# EAGLE design placa_sensor1 (EAGLE 6.5.0)
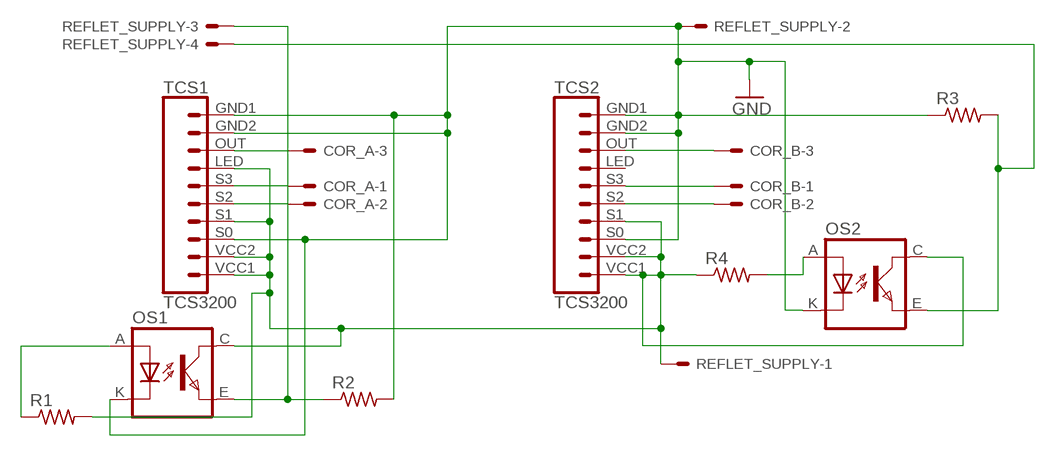
[diagram p0: schematic, sheet 1]

## Parts
COR_A  22-05-7038-03  [7395-03]
COR_B  22-05-7038-03  [7395-03]
OS1  TCRT5000  [TCRT5000]
OS2  TCRT5000  [TCRT5000]
R1  R-US_0204/5  [0204/5]
R2  R-US_0204/5  [0204/5]
R3  R-US_0204/5  [0204/5]
R4  R-US_0204/5  [0204/5]
REFLET_SUPPLY  22-05-7048-04  [7395-04]
TCS1  TCS3200  [TCS3200]
TCS2  TCS3200  [TCS3200]

## Nets
GND: OS1.K(CATHODE) OS2.K(CATHODE) R2.2 R3.1 REFLET_SUPPLY.2 TCS1.GND1 TCS1.GND2 TCS1.S0 TCS2.GND1 TCS2.GND2 TCS2.S0
N$1: COR_A.1 TCS1.S3
N$2: COR_A.3 TCS1.OUT
N$3: COR_A.2 TCS1.S2
N$4: COR_B.2 TCS2.S2
N$5: COR_B.3 TCS2.OUT
N$6: COR_B.1 TCS2.S3
N$8: OS1.A(ANODE) R1.1
N$9: OS1.E(EMITTER) R2.1 REFLET_SUPPLY.3
N$10: OS2.E(EMITTER) R3.2 REFLET_SUPPLY.4
N$11: OS2.A(ANODE) R4.2
N$12: OS1.C(COLLECTOR) OS2.C(COLLECTOR) R1.2 R4.1 REFLET_SUPPLY.1 TCS1.LED TCS1.S1 TCS1.VCC1 TCS1.VCC2 TCS2.S1 TCS2.VCC1 TCS2.VCC2
Unconnected: TCS2.LED

## Library data of the parts
COR_A COR_B = con-molex:22-?-03: CONNECTOR wire to board 2.54 mm (.1 inch) pitch header; OC_FARNELL: unknown; OC_NEWARK: unknown
OS1 OS2 = Robotica-IFRN-SC-sensores:TCRT5000
R1-R4 = rcl:R-US_: RESISTOR, American symbol
REFLET_SUPPLY = con-molex:22-?-04: CONNECTOR wire to board 2.54 mm (.1 inch) pitch header; OC_FARNELL: unknown; OC_NEWARK: unknown
TCS1 TCS2 = Robotica-IFRN-SC:TCS3200

## Board
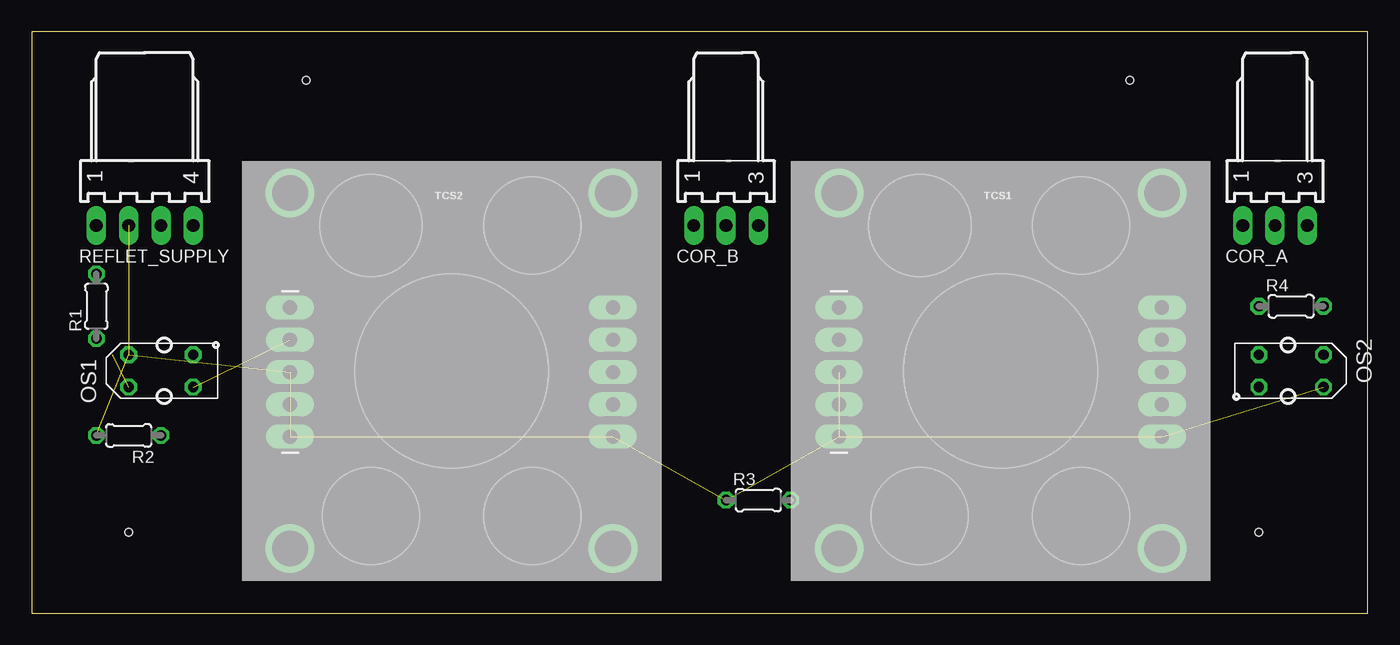
[diagram p1: board, top side]
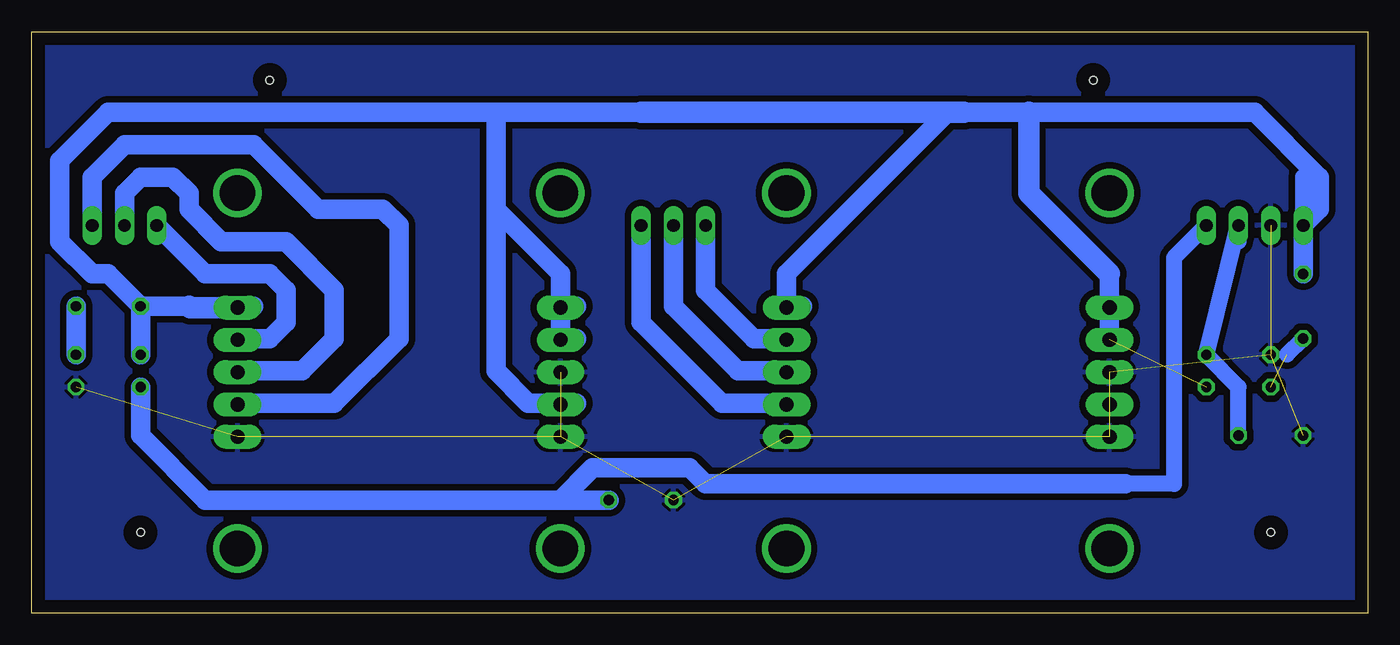
[diagram p2: board, bottom side, seen from below]

Size 105.08 x 45.71 mm. Coordinates in mm from the lower left corner, seen from the top.
Outline: 0,0 105.08,0 105.08,45.71 0,45.71 0,0
Copper layers (1*16): Top 0.035mm / dielectric 1.5mm / Bottom 0.035mm
Design rules "default *": minimum track width 50mil, minimum drill 24mil, track to track 20mil, track to pad 20mil, pad to pad 20mil, via to via 20mil, smd to smd 8mil, copper to edge 40mil, drill to drill 8mil, minimum pad ring 10mil, minimum via ring 8mil, stop-mask expansion 4mil, vias tented up to drill 0mil, thermal gap 10mil
Holes 0.6 mm at 7.62,6.35 96.52,6.35 21.59,41.91 86.36,41.91

### Footprints (pad centres in the part's own frame; a part is rotated, then mirrored left to right if it is on the bottom)
7395-03 = drill 1.016 long: 1 2.54,0; 2 0,0; 3 -2.54,0
TCRT5000 = drill 0.8 octagon: A -2.54,-1.27; C 2.54,-1.27; E 2.54,1.27; K -2.54,1.27
0204/5 = drill 0.813 octagon: 1 -2.54,0; 2 2.54,0
7395-04 = drill 1.016 long: 1 3.81,0; 2 1.27,0; 3 -1.27,0; 4 -3.81,0
TCS3200 = drill 1.118 pad 1.88 long: GND1 3.82,-11.33; GND2 29.22,-11.33; LED 29.22,-13.87; OUT 3.82,-13.87; S0 29.22,-16.41; S1 29.22,-18.95; S2 3.82,-16.41; S3 3.82,-18.95; VCC1 3.82,-21.49; VCC2 29.22,-21.49 | drill 2.8: P$1 3.81,-30.48; P$2 3.81,-2.54; P$3 29.21,-2.54; P$4 29.21,-30.48

### Placement (x,y rotation side)
COR_A  97.79,30.48 180 top
COR_B  54.61,30.48 180 top
OS1  10.16,19.05 0 top
OS2  99.06,19.05 180 top
R1  5.08,24.13 90 top
R2  7.62,13.97 180 top
R3  57.15,8.89 0 top
R4  99.06,24.13 0 top
REFLET_SUPPLY  8.89,30.48 180 top
TCS1  92.71,2.54 180 top
TCS2  49.53,2.54 180 top

### Tracks (layer width: path | path; a pad name or v marks a point on that pad's centre or on a via)
GND  (10 unrouted)
  pour Bottom: 0,45.72 104.14,45.72 104.14,0 0,0
N$1
  Bottom 1.524: COR_A.1 91.44,26.67 86.36,26.67 85.09,25.4 85.09,22.86 86.36,21.59 87.63,21.59 TCS1.S3
N$2
  Bottom 1.524: TCS1.OUT 87.63,16.51 81.28,16.51 76.2,21.59 76.2,30.48 77.47,31.75 82.55,31.75 87.63,36.83 97.79,36.83 100.33,34.29 COR_A.3
N$3
  Bottom 1.524: TCS1.S2 87.63,19.05 83.82,19.05 81.28,21.59 81.28,25.4 85.09,29.21 90.17,29.21 92.71,31.75 92.71,33.02 93.98,34.29 96.52,34.29 97.79,33.02 COR_A.2
N$4
  Bottom 1.524: COR_B.2 54.61,24.13 49.53,19.05 45.72,19.05 TCS2.S2
N$5
  Bottom 1.524: TCS2.OUT 45.72,16.51 50.8,16.51 57.15,22.86 COR_B.3
N$6
  Bottom 1.524: TCS2.S3 45.72,21.59 48.26,21.59 52.07,25.4 COR_B.1
N$8  (1 unrouted)
  Bottom 1.27: 6.35,20.32 R1.1
N$9
  Bottom 1.27: 10.16,29.21 REFLET_SUPPLY.3 OS1.E 10.16,17.78 R2.1
N$10
  Bottom 1.27: REFLET_SUPPLY.4 15.24,27.94 15.24,10.16 19.05,10.16
  Bottom 1.524: R3.2 63.5,8.89 | 63.5,8.89 91.44,8.89 96.52,13.97 OS2.E | 19.05,10.16 52.07,10.16 53.34,11.43 60.96,11.43 63.5,8.89
N$11
  Bottom 1.524: R4.2 OS2.A
N$12  (1 unrouted)
  Bottom 1.27: 63.5,24.13 TCS1.VCC2 | 92.71,24.03 92.81,24.03 | 5.08,31.75 REFLET_SUPPLY.1 5.08,34.29
  Bottom 1.524: 62.23,16.51 TCS1.LED 63.5,16.51 66.04,16.51 68.58,19.05 68.58,31.75 | 87.63,24.13 TCS1.VCC1 | 62.23,21.59 TCS1.S1 63.5,21.59 63.5,24.13 | 62.23,24.13 TCS1.VCC2 63.5,24.13 | R4.1 92.71,24.13 92.71,24.03 | R4.1 99.06,26.67 100.33,26.67 102.87,29.21 102.87,35.56 99.06,39.37 68.58,39.37 | R1.2 REFLET_SUPPLY.1 3.81,31.75 3.81,34.29 8.89,39.37 26.67,39.37 31.75,39.37 | 20.32,24.13 20.32,26.67 | 20.32,24.13 20.32,21.59 TCS2.S1 | 20.32,24.13 TCS2.VCC2 | 33.02,39.37 45.72,26.67 45.72,24.13 TCS2.VCC1 44.45,24.13 | 57.15,39.37 68.58,39.37 | 68.58,39.37 68.58,31.75 | 63.5,24.13 63.5,26.67 68.58,31.75 | R4.1 OS2.C
  Bottom 1.676: TCS1.VCC1 92.61,24.03 92.71,24.13 | 57.15,39.37 33.02,39.37 31.75,39.37 | 20.32,26.67 26.67,33.02 26.67,39.37